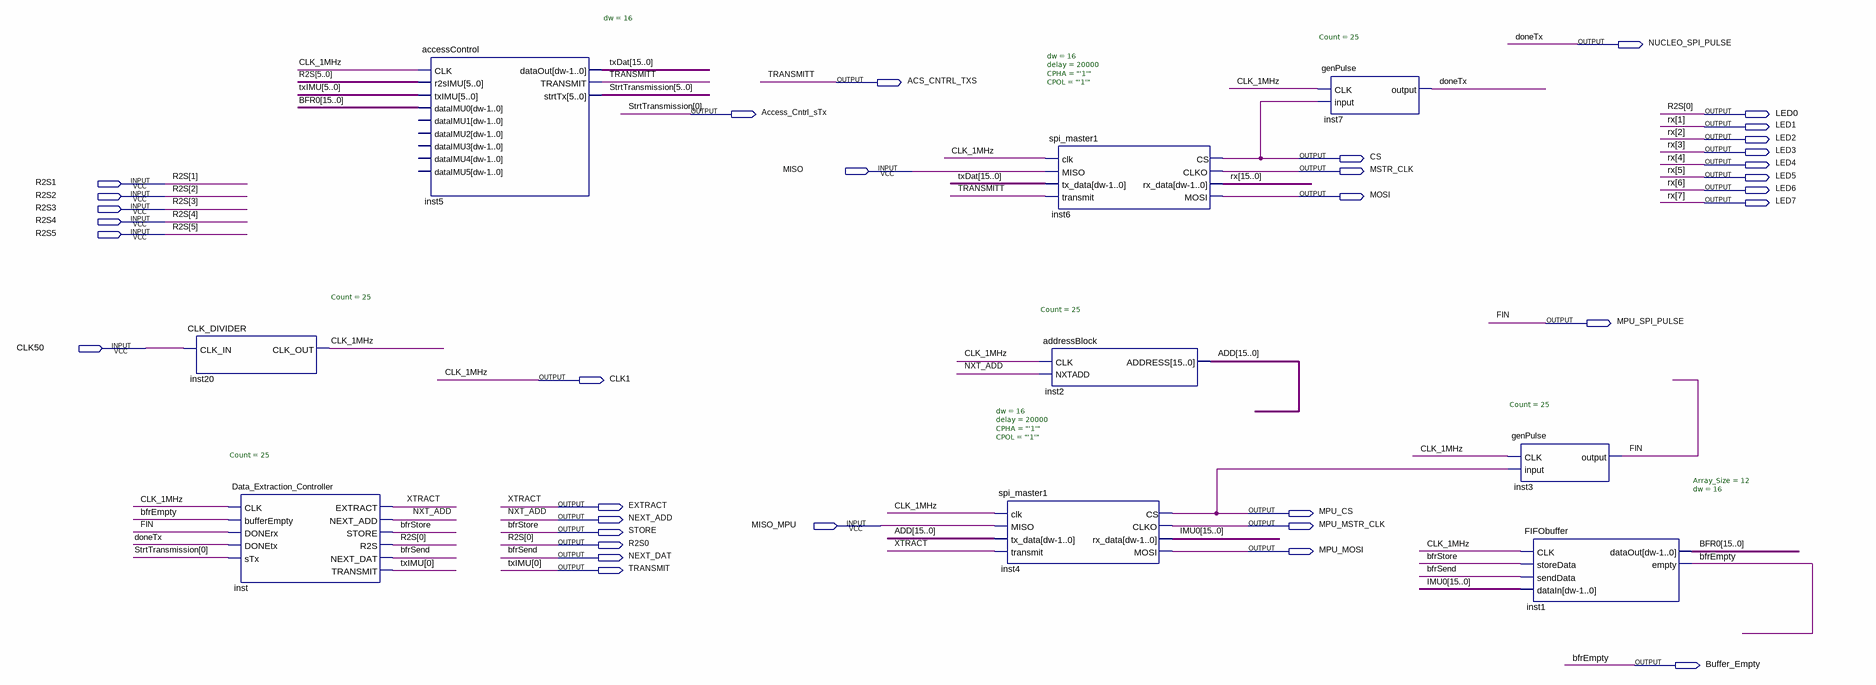
[diagram p0: schematic sheet]
// Quartus schematic DES_TEST.bdf as structural Verilog: 9 symbols, 34 pins
module DES_TEST (
  input  MISO,
  input  R2S1,
  input  R2S2,
  input  R2S3,
  input  R2S4,
  input  R2S5,
  input  CLK50,
  input  MISO_MPU,
  output NUCLEO_SPI_PULSE,
  output ACS_CNTRL_TXS,
  output Access_Cntrl_sTx,
  output LED0,
  output LED1,
  output LED2,
  output LED3,
  output CS,
  output LED4,
  output MSTR_CLK,
  output LED5,
  output LED6,
  output MOSI,
  output LED7,
  output MPU_SPI_PULSE,
  output CLK1,
  output EXTRACT,
  output MPU_CS,
  output NEXT_ADD,
  output MPU_MSTR_CLK,
  output STORE,
  output R2S0,
  output MPU_MOSI,
  output NEXT_DAT,
  output TRANSMIT,
  output Buffer_Empty
);

  wire [5:1] StrtTransmission, txIMU;
  wire [15:0] ADD, BFR0, IMU0, rx, txDat;

  CLK_DIVIDER #(.Count(25)) inst20 (.CLK_IN(CLK50), .CLK_OUT(CLK1));
  Data_Extraction_Controller #(.Count(25)) inst (
    .CLK(CLK1), .bufferEmpty(Buffer_Empty), .DONErx(MPU_SPI_PULSE), .DONEtx(NUCLEO_SPI_PULSE),
    .sTx(Access_Cntrl_sTx), .EXTRACT(EXTRACT), .NEXT_ADD(NEXT_ADD), .STORE(STORE), .R2S(LED0),
    .NEXT_DAT(NEXT_DAT), .TRANSMIT(TRANSMIT));
  accessControl #(.dw(16)) inst5 (
    .CLK(CLK1), .r2sIMU({R2S5, R2S4, R2S3, R2S2, R2S1, LED0}), .txIMU({txIMU, TRANSMIT}), .dataIMU0(BFR0),
    .dataOut(txDat), .TRANSMIT(ACS_CNTRL_TXS), .strtTx({StrtTransmission, Access_Cntrl_sTx}));  // open: dataIMU1, dataIMU2, dataIMU3, dataIMU4, dataIMU5
  spi_master1 #(.dw(16), .delay(20000), .CPHA("'1'"), .CPOL("'1'")) inst4 (
    .clk(CLK1), .MISO(MISO_MPU), .tx_data(ADD), .transmit(EXTRACT), .CS(MPU_CS), .CLKO(MPU_MSTR_CLK),
    .rx_data(IMU0), .MOSI(MPU_MOSI));
  spi_master1 #(.dw(16), .delay(20000), .CPHA("'1'"), .CPOL("'1'")) inst6 (
    .clk(CLK1), .MISO(MISO), .tx_data(txDat), .transmit(ACS_CNTRL_TXS), .CS(CS), .CLKO(MSTR_CLK),
    .rx_data({rx[15:8], LED7, LED6, LED5, LED4, LED3, LED2, LED1, rx[0]}), .MOSI(MOSI));
  addressBlock #(.Count(25)) inst2 (.CLK(CLK1), .NXTADD(NEXT_ADD), .ADDRESS(ADD));
  genPulse #(.Count(25)) inst7 (.CLK(CLK1), .\input (CS), .\output (NUCLEO_SPI_PULSE));
  genPulse #(.Count(25)) inst3 (.CLK(CLK1), .\input (MPU_CS), .\output (MPU_SPI_PULSE));
  FIFObuffer #(.Array_Size(12), .dw(16)) inst1 (
    .CLK(CLK1), .storeData(STORE), .sendData(NEXT_DAT), .dataIn(IMU0), .dataOut(BFR0), .empty(Buffer_Empty));

  assign R2S0 = LED0;

  // Other names for the same wires on the sheet: bfrEmpty = Buffer_Empty; bfrSend = NEXT_DAT; bfrStore = STORE;
  //   CLK_1MHz = CLK1; doneTx = NUCLEO_SPI_PULSE; FIN = MPU_SPI_PULSE; NXT_ADD = NEXT_ADD; R2S[0] = LED0;
  //   rx[7:1] = {LED7, LED6, LED5, LED4, LED3, LED2, LED1}; StrtTransmission[0] = Access_Cntrl_sTx;
  //   TRANSMITT = ACS_CNTRL_TXS; txIMU[0] = TRANSMIT; XTRACT = EXTRACT
endmodule
